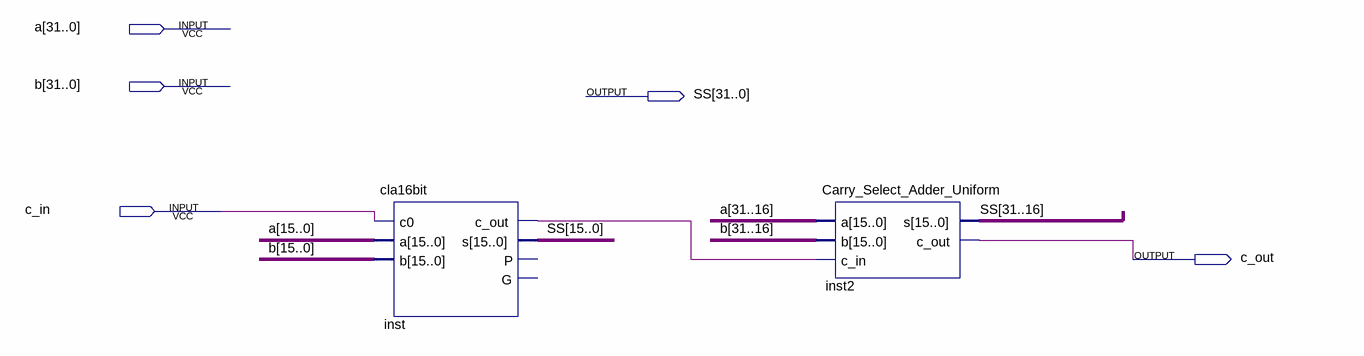
[diagram p0: schematic sheet]
// Quartus schematic adder32bit_part5.bdf as structural Verilog: 2 symbols, 5 pins
module adder32bit_part5 (
  input  [31:0] a,
  input  [31:0] b,
  input  c_in,
  output [31:0] SS,
  output c_out
);

  wire inst_c_out;

  cla16bit inst (.c0(c_in), .a(a[15:0]), .b(b[15:0]), .c_out(inst_c_out), .s(SS[15:0]));  // open: P, G
  Carry_Select_Adder_Uniform inst2 (.a(a[31:16]), .b(b[31:16]), .c_in(inst_c_out), .s(SS[31:16]), .c_out(c_out));
endmodule
